# EAGLE design MEGAMOTHERBOARD (EAGLE 7.6.0)
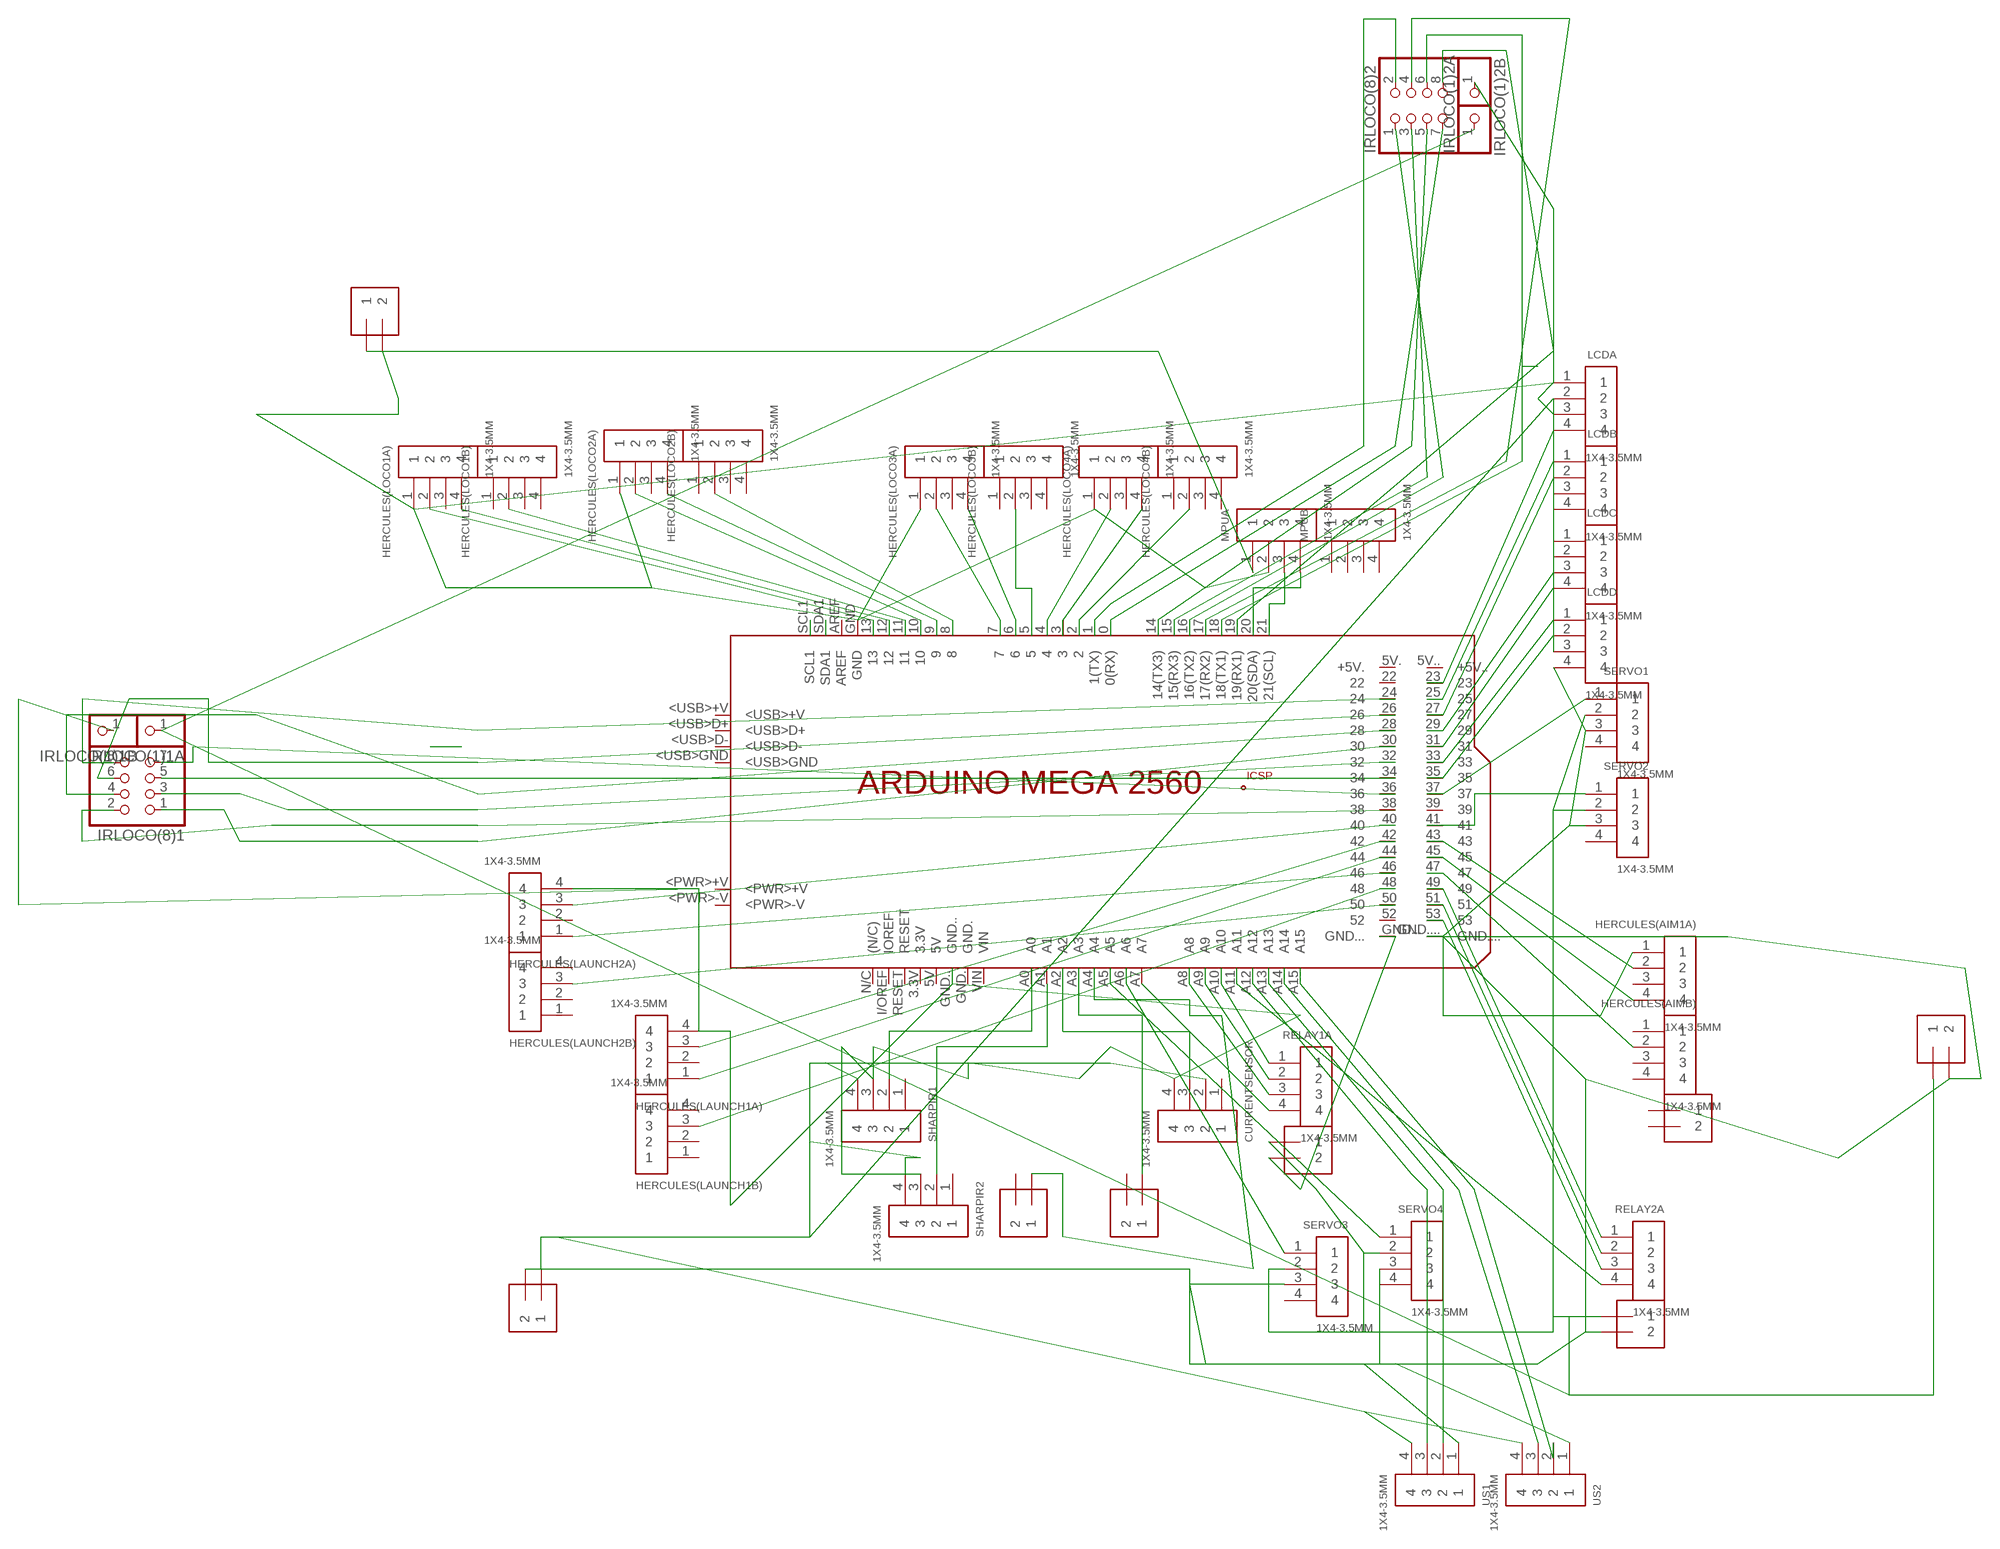
[diagram p0: schematic, sheet 1]

## Parts
3.3V  1X2-3.5MM  [1X2-3.5MM]
5V  1X2-3.5MM  [1X2-3.5MM]
12V  1X2-3.5MM  [1X2-3.5MM]
CURRENTSENSOR  1X4-3.5MM  [1X04-3.5MM]
HERCULES(AIM1A)  1X4-3.5MM  [1X04-3.5MM]
HERCULES(AIM1C)  1X2-3.5MM  [1X2-3.5MM]
HERCULES(AIMB)  1X4-3.5MM  [1X04-3.5MM]
HERCULES(LAUNCH1A)  1X4-3.5MM  [1X04-3.5MM]
HERCULES(LAUNCH1B)  1X4-3.5MM  [1X04-3.5MM]
HERCULES(LAUNCH2A)  1X4-3.5MM  [1X04-3.5MM]
HERCULES(LAUNCH2B)  1X4-3.5MM  [1X04-3.5MM]
HERCULES(LOCO1A)  1X4-3.5MM  [1X04-3.5MM]
HERCULES(LOCO1B)  1X4-3.5MM  [1X04-3.5MM]
HERCULES(LOCO2A)  1X4-3.5MM  [1X04-3.5MM]
HERCULES(LOCO2B)  1X4-3.5MM  [1X04-3.5MM]
HERCULES(LOCO3A)  1X4-3.5MM  [1X04-3.5MM]
HERCULES(LOCO3B)  1X4-3.5MM  [1X04-3.5MM]
HERCULES(LOCO4A)  1X4-3.5MM  [1X04-3.5MM]
HERCULES(LOCO4B)  1X4-3.5MM  [1X04-3.5MM]
IRLOCO1ANALOG  1X2-3.5MM  [1X2-3.5MM]
IRLOCO2ANALOG  1X2-3.5MM  [1X2-3.5MM]
IRLOCO(1)1A  PINHD-1X1  [1X01]
IRLOCO(1)1B  PINHD-1X1  [1X01]
IRLOCO(1)2A  PINHD-1X1  [1X01]
IRLOCO(1)2B  PINHD-1X1  [1X01]
IRLOCO(8)1  PINHD-2X4  [2X04]
IRLOCO(8)2  PINHD-2X4  [2X04]
LCDA  1X4-3.5MM  [1X04-3.5MM]
LCDB  1X4-3.5MM  [1X04-3.5MM]
LCDC  1X4-3.5MM  [1X04-3.5MM]
LCDD  1X4-3.5MM  [1X04-3.5MM]
MPUA  1X4-3.5MM  [1X04-3.5MM]
MPUB  1X4-3.5MM  [1X04-3.5MM]
PCB1  ARDUINO_MEGA2560  [ARDUINO_MEGA2560]
RELAY1A  1X4-3.5MM  [1X04-3.5MM]
RELAY1B  1X2-3.5MM  [1X2-3.5MM]
RELAY2A  1X4-3.5MM  [1X04-3.5MM]
RELAY2B  1X2-3.5MM  [1X2-3.5MM]
SERVO1  1X4-3.5MM  [1X04-3.5MM]
SERVO2  1X4-3.5MM  [1X04-3.5MM]
SERVO3  1X4-3.5MM  [1X04-3.5MM]
SERVO4  1X4-3.5MM  [1X04-3.5MM]
SHARPIR1  1X4-3.5MM  [1X04-3.5MM]
SHARPIR2  1X4-3.5MM  [1X04-3.5MM]
US1  1X4-3.5MM  [1X04-3.5MM]
US2  1X4-3.5MM  [1X04-3.5MM]

## Nets
3.3V: 3.3V.1 MPUA.1
5V: 5V.1 CURRENTSENSOR.2 LCDA.2 LCDD.3 SHARPIR1.4 SHARPIR2.4 US1.4 US2.4
12V: 12V.1 IRLOCO(1)1A.1 IRLOCO(1)2A.1 RELAY1B.1 RELAY2B.1 SERVO1.2 SERVO2.2 SERVO3.2 SERVO4.2
CURRRENTSENSOR(ANALOG): CURRENTSENSOR.3 PCB1.A2
D0: LCDD.2 PCB1.35
D1: LCDD.1 PCB1.33
D2: LCDC.4 PCB1.31
D3: LCDC.3 PCB1.29
DIR1(HERCULESLAUNCH1): HERCULES(LAUNCH1A).3 PCB1.42
DIR1(HERCULESLAUNCH2): HERCULES(LAUNCH2A).3 PCB1.40
DIR1(HERCULESLOCO1): HERCULES(LOCO1A).2 PCB1.13
DIR1(HERCULESLOCO2): HERCULES(LOCO2A).2 PCB1.10
DIR1(HERCULESLOCO3): HERCULES(LOCO3A).2 PCB1.7
DIR1(HERCULESLOCO4): HERCULES(LOCO4A).2 PCB1.4
DIR2(HERCULESLAUNCH2): HERCULES(LAUNCH2B).3 PCB1.50
DIR2(HERCULESLAUNCH): HERCULES(LAUNCH1B).3 PCB1.48
DIR2(HERCULESLOCO1): HERCULES(LOCO1B).2 PCB1.11
DIR2(HERCULESLOCO2): HERCULES(LOCO2B).2 PCB1.8
DIR2(HERCULESLOCO3): HERCULES(LOCO3B).2 PCB1.5
DIR2HERCULESLOCO4): HERCULES(LOCO4B).2 PCB1.2
ECHO(US1): PCB1.A13 US1.2
ECHO(US2): PCB1.A15 US2.2
ENABLE: LCDB.1 PCB1.25
GND1: CURRENTSENSOR.4 HERCULES(LAUNCH1A).4 HERCULES(LAUNCH2A).4 IRLOCO(1)1B.1 PCB1.GND.. SHARPIR1.3 SHARPIR2.3
GND3: 5V.2 12V.2 HERCULES(AIM1A).1 LCDD.4 PCB1.GND.... RELAY2B.2 SERVO1.3 SERVO2.3 SERVO3.3 SERVO4.3 US1.1 US2.1
GND4: 3.3V.2 HERCULES(LOCO1A).1 HERCULES(LOCO2A).1 HERCULES(LOCO3A).1 HERCULES(LOCO4A).1 IRLOCO(1)2B.1 LCDA.1 LCDA.3 MPUA.2 PCB1.GND
HERCULES(AIM)DIR1: HERCULES(AIM1A).2 PCB1.43
HERCULES(AIM)DIR2: HERCULES(AIMB).2 PCB1.47
HERCULES(AIM)PWM: HERCULES(AIM1A).4 PCB1.45
IR1(D1): IRLOCO(8)2.1 PCB1.16(16(TX2))
IR1(D2): IRLOCO(8)2.2 PCB1.1(1(TX))
IR1(D3): IRLOCO(8)2.3 PCB1.15(15(RX3))
IR1(D4): IRLOCO(8)2.4 PCB1.17(17(RX2))
IR1(D5): IRLOCO(8)2.5 PCB1.14(14(TX3))
IR1(D6): IRLOCO(8)2.6 PCB1.18(18(TX1))
IR1(D8): IRLOCO(8)2.8 PCB1.19(19(RX1))
IR(D7): IRLOCO(8)2.7 PCB1.0(0(RX))
IRLOCO1: IRLOCO(8)1.1 PCB1.30
IRLOCO1(2): IRLOCO(8)1.2 PCB1.38
IRLOCO1(3): IRLOCO(8)1.3 PCB1.32
IRLOCO1(4): IRLOCO(8)1.4 PCB1.28
IRLOCO1(5): IRLOCO(8)1.5 PCB1.34
IRLOCO1(6): IRLOCO(8)1.6 PCB1.26
IRLOCO1(7): IRLOCO(8)1.7 PCB1.36
IRLOCO1(8): IRLOCO(8)1.8 PCB1.24
IRSENSORANALOG1(LOCO): IRLOCO2ANALOG.1 PCB1.A3
IRSENSORANALOG2(LOCO): IRLOCO1ANALOG.1 PCB1.A4
N$1: PCB1.41 SERVO2.1
N$2: PCB1.GND... RELAY1B.2
N$14: PCB1.SCL1
N$19: PCB1.SDA1
PWM1(HERCULESLOCO1): HERCULES(LOCO1A).4 PCB1.12
PWM(HERCULESLAUNCH2): HERCULES(LAUNCH2A).1 PCB1.46
PWM(HERCULESLAUNCH): HERCULES(LAUNCH1A).1 PCB1.44
PWM(HERCULESLOCO2): HERCULES(LOCO2A).4 PCB1.9
PWM(HERCULESLOCO3): HERCULES(LOCO3A).4 PCB1.6
PWM(HERCULESLOCO4): HERCULES(LOCO4A).4 PCB1.3
R/W: LCDB.2 PCB1.27
REGISTERSELECT: LCDA.4 PCB1.23
RELAY1(1): PCB1.A10 RELAY1A.1
RELAY1(2): PCB1.A9 RELAY1A.2
RELAY1(3): PCB1.A8 RELAY1A.3
RELAY1(4): PCB1.A7 RELAY1A.4
RELAY2(1): PCB1.49 RELAY2A.1
RELAY2(2): PCB1.51 RELAY2A.2
RELAY2(3): PCB1.53 RELAY2A.3
RELAY2(4): PCB1.A11 RELAY2A.4
SCL: MPUA.3 PCB1.21(21(SCL))
SDA: MPUA.4 PCB1.20(20(SDA))
SERVO1(I/P): PCB1.37 SERVO1.1
SERVO3(IPUT): PCB1.A6 SERVO3.1
SERVO4(I/P): PCB1.A5 SERVO4.1
SHARPIR2(ANALOG): PCB1.A1 SHARPIR2.2
SHARPIR(ANALOG1): PCB1.A0 SHARPIR1.2
TRIG(US1): PCB1.A12 US1.3
TRIG(US2): PCB1.A14 US2.3
Unconnected: CURRENTSENSOR.1 HERCULES(AIM1A).3 HERCULES(AIM1C).1 HERCULES(AIM1C).2 HERCULES(AIMB).1 HERCULES(AIMB).3 HERCULES(AIMB).4 HERCULES(LAUNCH1A).2 HERCULES(LAUNCH1B).1 HERCULES(LAUNCH1B).2 HERCULES(LAUNCH1B).4 HERCULES(LAUNCH2A).2 HERCULES(LAUNCH2B).1 HERCULES(LAUNCH2B).2 HERCULES(LAUNCH2B).4 HERCULES(LOCO1A).3 HERCULES(LOCO1B).1 HERCULES(LOCO1B).3 HERCULES(LOCO1B).4 HERCULES(LOCO2A).3 HERCULES(LOCO2B).1 HERCULES(LOCO2B).3 HERCULES(LOCO2B).4 HERCULES(LOCO3A).3 HERCULES(LOCO3B).1 HERCULES(LOCO3B).3 HERCULES(LOCO3B).4 HERCULES(LOCO4A).3 HERCULES(LOCO4B).1 HERCULES(LOCO4B).3 HERCULES(LOCO4B).4 IRLOCO1ANALOG.2 IRLOCO2ANALOG.2 LCDB.3 LCDB.4 LCDC.1 LCDC.2 MPUB.1 MPUB.2 MPUB.3 MPUB.4 PCB1.3.3V PCB1.5V PCB1.5V.(+5V.) PCB1.5V..(+5V..) PCB1.22 PCB1.39 PCB1.52 PCB1.+5V_ PCB1.<PWR>+V PCB1.<PWR>-V PCB1.<USB>+V PCB1.<USB>D+ PCB1.<USB>D- PCB1.<USB>GND PCB1.AREF PCB1.GND. PCB1.GND__ PCB1.I/OREF(IOREF) PCB1.MISO PCB1.MOSI PCB1.N/C((N/C)) PCB1.RESET PCB1.RESET. PCB1.SCK PCB1.VIN SERVO1.4 SERVO2.4 SERVO3.4 SERVO4.4 SHARPIR1.1 SHARPIR2.1

## Library data of the parts
3.3V 5V 12V HERCULES(AIM1C) IRLOCO1ANALOG IRLOCO2ANALOG RELAY1B RELAY2B = adafruit:1X2: 3.5mm Terminal block http://www.ladyada.net/library/pcb/eaglelibrary.html
CURRENTSENSOR HERCULES(AIM1A) HERCULES(AIMB) HERCULES(LAUNCH1A) HERCULES(LAUNCH1B) HERCULES(LAUNCH2A) HERCULES(LAUNCH2B) HERCULES(LOCO1A) HERCULES(LOCO1B) HERCULES(LOCO2A) HERCULES(LOCO2B) HERCULES(LOCO3A) HERCULES(LOCO3B) HERCULES(LOCO4A) HERCULES(LOCO4B) LCDA LCDB LCDC LCDD MPUA MPUB RELAY1A RELAY2A SERVO1-SERVO4 SHARPIR1 SHARPIR2 US1 US2 = adafruit:1X4: 4-pin connector
IRLOCO(1)1A IRLOCO(1)1B IRLOCO(1)2A IRLOCO(1)2B = adafruit:PINHD-1X1: Pin header 1x1 for 0.1" spacing With round pins
IRLOCO(8)1 IRLOCO(8)2 = adafruit:PINHD-2X4: PIN HEADER
PCB1 = E14_Arduino_revC:ARDUINO_MEGA2560: Device for representing an Arduino Mega 2560 board with a footprint in an EAGLE design. Created by Dave Young for Element14. More EAGLE documentation at: http://www.element14.com/community/community/knode/cadsoft_eagle

## Board
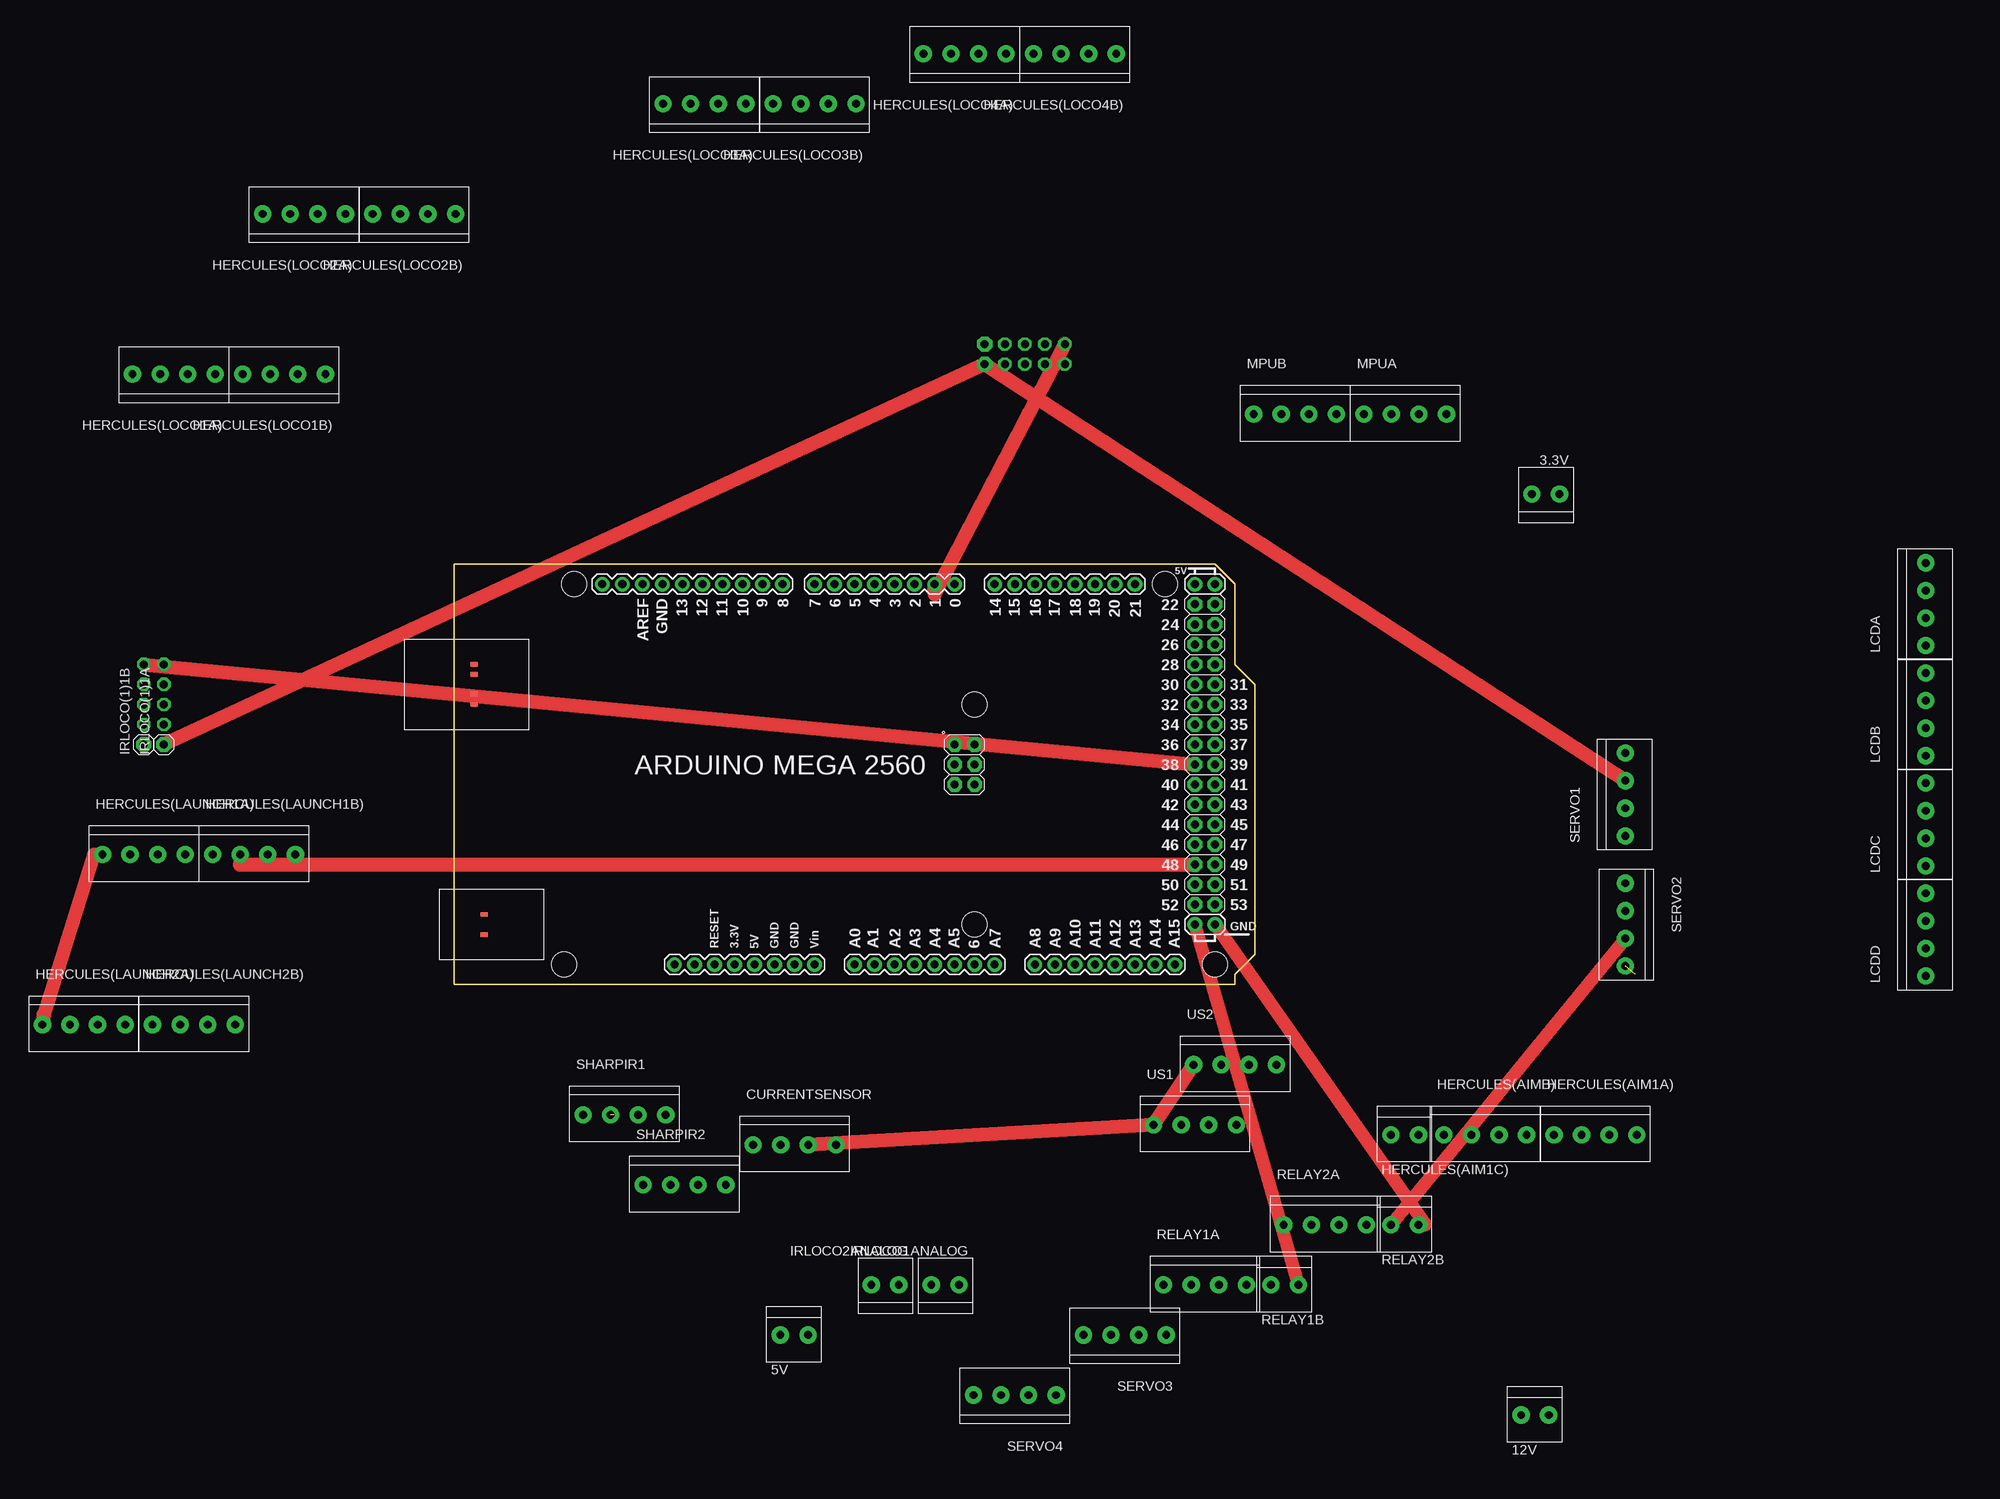
[diagram p1: board, top side]
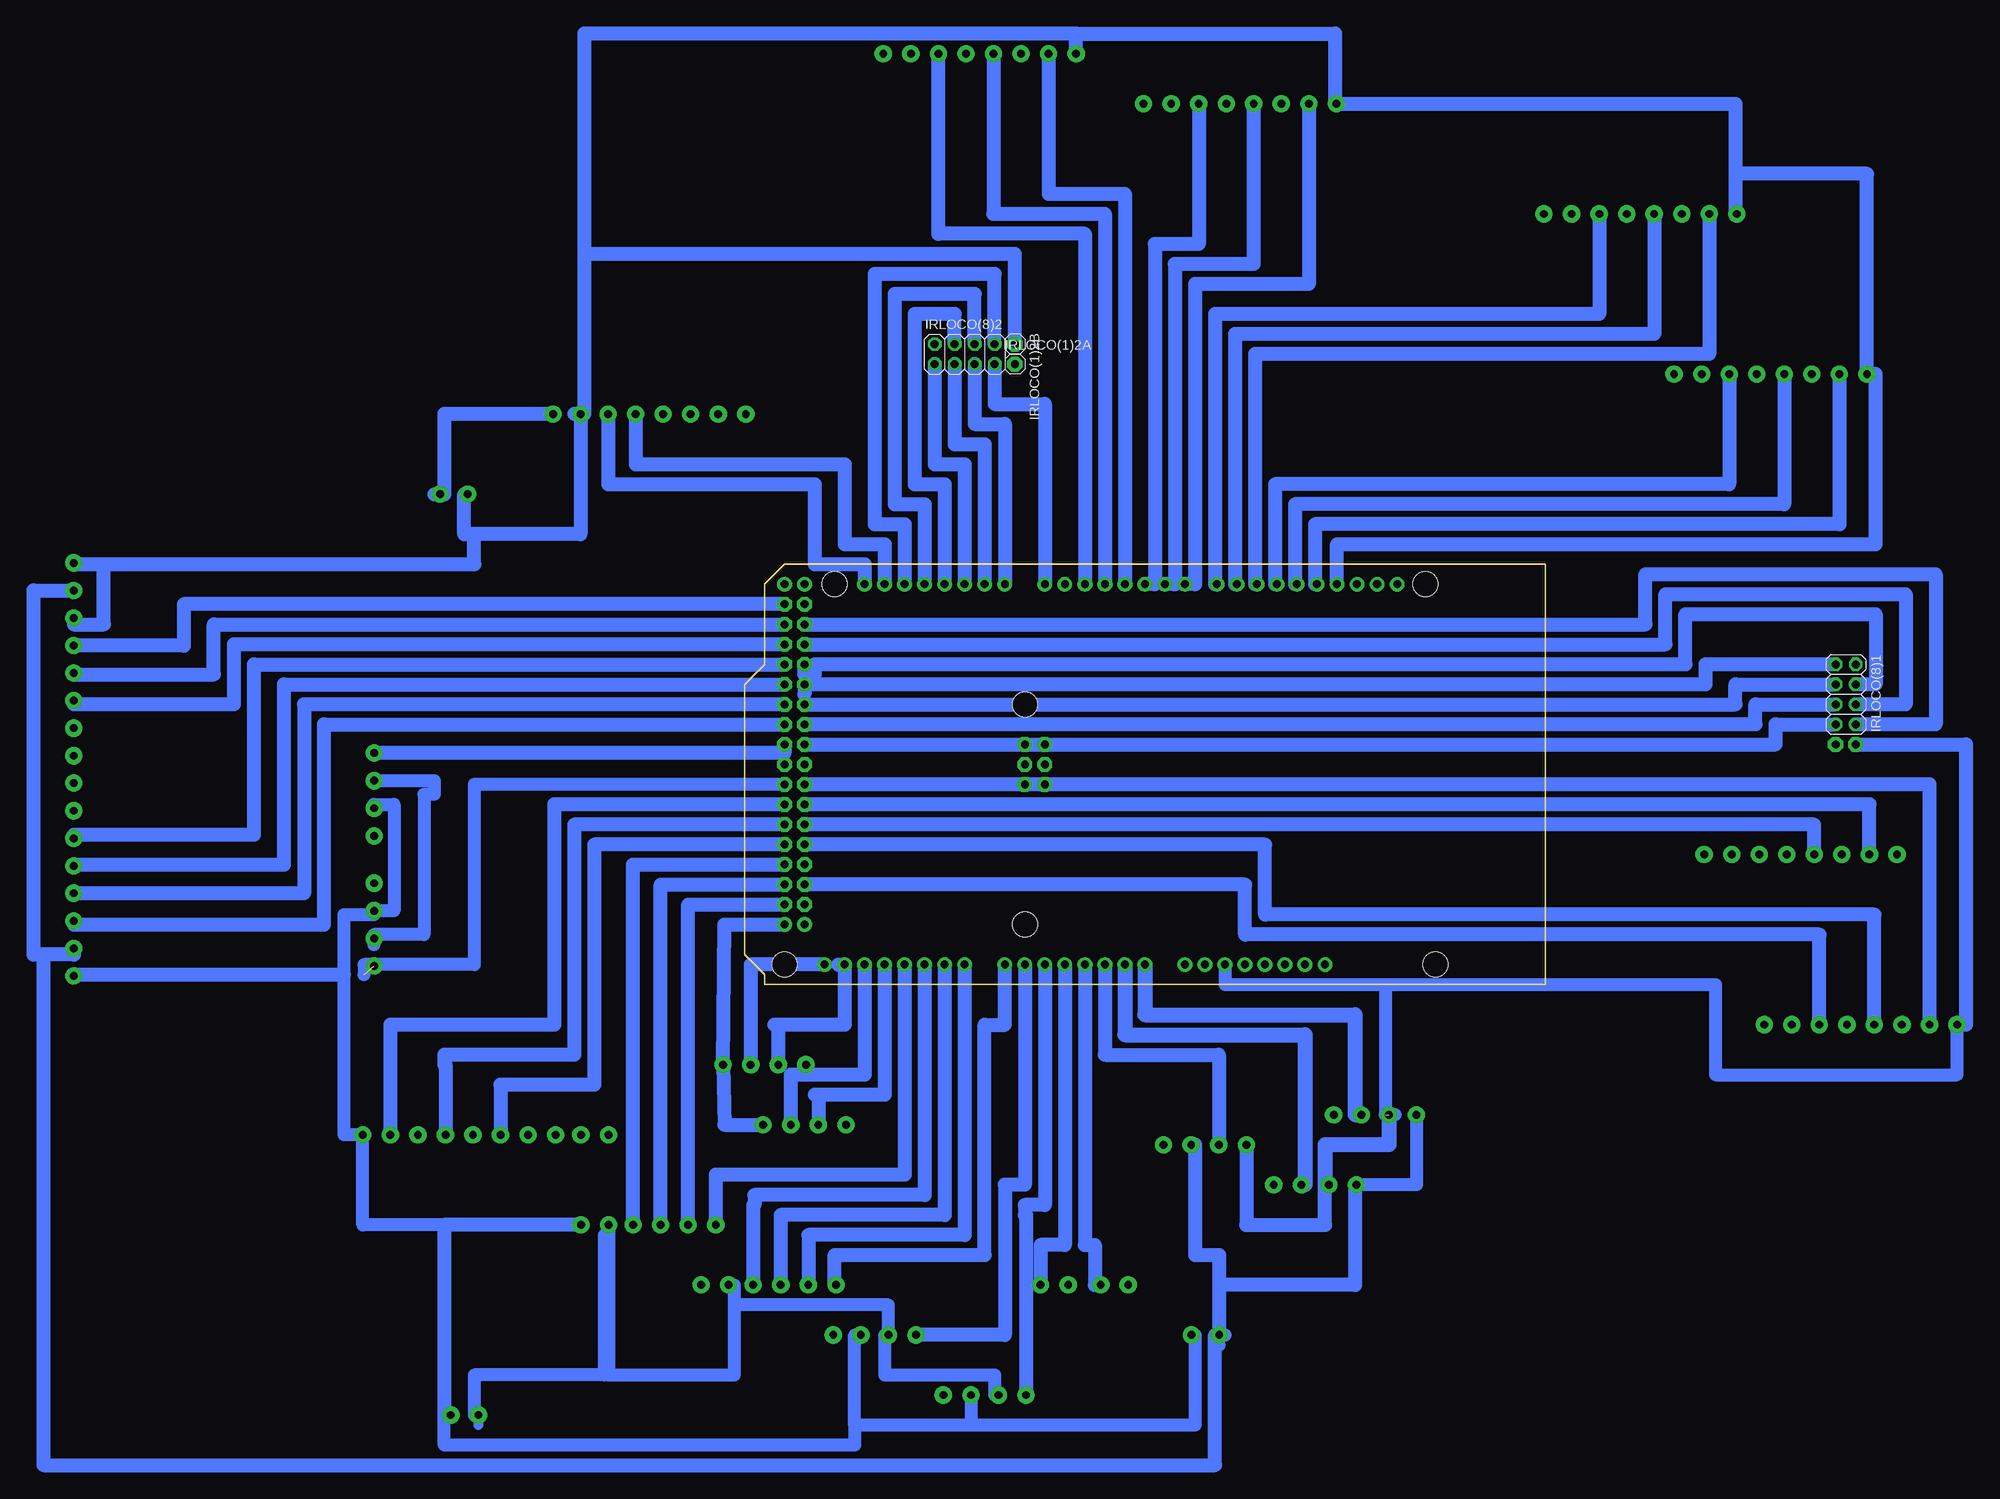
[diagram p2: board, bottom side, seen from below]

Size 101.6 x 53.34 mm. Coordinates in mm from the lower left corner, seen from the top.
Copper layers (1*16): Top 0.035mm / dielectric 1.5mm / Bottom 0.035mm
Design rules "default": minimum track width 10mil, minimum drill 24mil, track to track 8mil, track to pad 8mil, pad to pad 8mil, via to via 8mil, smd to smd 8mil, copper to edge 40mil, drill to drill 8mil, minimum pad ring 10mil, minimum via ring 8mil, stop-mask expansion 4mil, vias tented up to drill 0mil, thermal gap 10mil
Holes 0.6 mm at 349.25,13.97

### Footprints (pad centres in the part's own frame; a part is rotated, then mirrored left to right if it is on the bottom)
1X2-3.5MM = drill 1 pad 2.184: 1 1.8,0; 2 -1.7,0
1X04-3.5MM = drill 1 pad 2.184: 1 -5.25,0; 2 -1.75,0; 3 1.75,0; 4 5.25,0
1X01 = drill 1.016 pad 1.93 octagon: 1 0,0
2X04 = drill 1.016 pad 1.676 octagon: 1 -3.81,-1.27; 2 -3.81,1.27; 3 -1.27,-1.27; 4 -1.27,1.27; 5 1.27,-1.27; 6 1.27,1.27; 7 3.81,-1.27; 8 3.81,1.27
ARDUINO_MEGA2560 = drill 1.016 pad 1.88: 0 63.5,50.8; 1 60.96,50.8; 2 58.42,50.8; 3 55.88,50.8; 3.3V 35.56,2.54; 4 53.34,50.8; 5 50.8,50.8; 5V 38.1,2.54; 5V. 93.98,50.8; 5V.. 96.52,50.8; 6 48.26,50.8; 7 45.72,50.8; 8 41.656,50.8; 9 39.116,50.8; 10 36.576,50.8; 11 34.036,50.8; 12 31.496,50.8; 13 28.956,50.8; 14 68.58,50.8; 15 71.12,50.8; 16 73.66,50.8; 17 76.2,50.8; 18 78.74,50.8; 19 81.28,50.8; 20 83.82,50.8; 21 86.36,50.8; A0 50.8,2.54; A1 53.34,2.54; A2 55.88,2.54; A3 58.42,2.54; A4 60.96,2.54; A5 63.5,2.54; A6 66.04,2.54; A7 68.58,2.54; A8 73.66,2.54; A9 76.2,2.54; A10 78.74,2.54; A11 81.28,2.54; A12 83.82,2.54; A13 86.36,2.54; A14 88.9,2.54; A15 91.44,2.54; AREF 23.876,50.8; GND 26.416,50.8; GND. 43.18,2.54; GND.. 40.64,2.54; GND... 93.98,7.62; GND.... 96.52,7.62; I/OREF 30.48,2.54; N/C 27.94,2.54; RESET 33.02,2.54; SCL1 18.796,50.8; SDA1 21.336,50.8; VIN 45.72,2.54 | drill 1.016 pad 1.88 octagon: 22 93.98,48.26; 23 96.52,48.26; 24 93.98,45.72; 25 96.52,45.72; 26 93.98,43.18; 27 96.52,43.18; 28 93.98,40.64; 29 96.52,40.64; 30 93.98,38.1; 31 96.52,38.1; 32 93.98,35.56; 33 96.52,35.56; 34 93.98,33.02; 35 96.52,33.02; 36 93.98,30.48; 37 96.52,30.48; 38 93.98,27.94; 39 96.52,27.94; 40 93.98,25.4; 41 96.52,25.4; 42 93.98,22.86; 43 96.52,22.86; 44 93.98,20.32; 45 96.52,20.32; 46 93.98,17.78; 47 96.52,17.78; 48 93.98,15.24; 49 96.52,15.24; 50 93.98,12.7; 51 96.52,12.7; 52 93.98,10.16; 53 96.52,10.16; +5V_ 66.04,30.48; GND__ 66.04,25.4; MISO 63.5,30.48; MOSI 66.04,27.94; RESET. 63.5,25.4; SCK 63.5,27.94 | smd 1.016 x 0.508: <PWR>+V 3.81,8.89; <PWR>-V 3.81,6.35; <USB>+V 2.54,40.64; <USB>D+ 2.54,39.37; <USB>D- 2.54,36.83; <USB>GND 2.54,35.56 | hole 3.2: 15.24,50.8; 13.97,2.54; 66.04,35.56; 66.04,7.62; 90.17,50.8; 96.52,2.54

### Placement (x,y rotation side)
3.3V  138.43,62.23 0 top  (outside the outline)
5V  43.18,-44.45 180 top  (outside the outline)
12V  137.16,-54.61 180 top  (outside the outline)
CURRENTSENSOR  43.18,-20.32 180 top  (outside the outline)
HERCULES(AIM1A)  144.78,-19.05 180 top  (outside the outline)
HERCULES(AIM1C)  120.65,-19.05 180 top  (outside the outline)
HERCULES(AIMB)  130.81,-19.05 180 top  (outside the outline)
HERCULES(LAUNCH1A)  -39.37,16.51 180 top  (outside the outline)
HERCULES(LAUNCH1B)  -25.4,16.51 180 top  (outside the outline)
HERCULES(LAUNCH2A)  -46.99,-5.08 180 top  (outside the outline)
HERCULES(LAUNCH2B)  -33.02,-5.08 180 top  (outside the outline)
HERCULES(LOCO1A)  -35.56,77.47 0 top  (outside the outline)
HERCULES(LOCO1B)  -21.59,77.47 0 top  (outside the outline)
HERCULES(LOCO2A)  -19.05,97.79 0 top  (outside the outline)
HERCULES(LOCO2B)  -5.08,97.79 0 top  (outside the outline)
HERCULES(LOCO3A)  31.75,111.76 0 top  (outside the outline)
HERCULES(LOCO3B)  45.72,111.76 0 top  (outside the outline)
HERCULES(LOCO4A)  64.77,118.11 0 top  (outside the outline)
HERCULES(LOCO4B)  78.74,118.11 0 top  (outside the outline)
IRLOCO1ANALOG  62.23,-38.1 0 top  (outside the outline)
IRLOCO2ANALOG  54.61,-38.1 0 top  (outside the outline)
IRLOCO(1)1A  -36.83,30.48 90 top  (outside the outline)
IRLOCO(1)1B  -39.37,30.48 90 top  (outside the outline)
IRLOCO(1)2A  67.31,78.74 0 bottom  (outside the outline)
IRLOCO(1)2B  67.31,81.28 270 bottom  (outside the outline)
IRLOCO(8)1  -38.1,36.83 270 bottom  (outside the outline)
IRLOCO(8)2  73.66,80.01 0 bottom  (outside the outline)
LCDA  186.69,48.26 270 top  (outside the outline)
LCDB  186.69,34.29 270 top  (outside the outline)
LCDC  186.69,20.32 270 top  (outside the outline)
LCDD  186.69,6.35 270 top  (outside the outline)
MPUA  120.65,72.39 180 top  (outside the outline)
MPUB  106.68,72.39 180 top  (outside the outline)
PCB1  0,0 0 top
RELAY1A  95.25,-38.1 180 top  (outside the outline)
RELAY1B  105.41,-38.1 180 top  (outside the outline)
RELAY2A  110.49,-30.48 180 top  (outside the outline)
RELAY2B  120.65,-30.48 180 top  (outside the outline)
SERVO1  148.59,24.13 270 top  (outside the outline)
SERVO2  148.59,7.62 90 top  (outside the outline)
SERVO3  85.09,-44.45 0 top  (outside the outline)
SERVO4  71.12,-52.07 0 top  (outside the outline)
SHARPIR1  21.59,-16.51 180 top  (outside the outline)
SHARPIR2  29.21,-25.4 180 top  (outside the outline)
US1  93.98,-17.78 180 top  (outside the outline)
US2  99.06,-10.16 180 top  (outside the outline)

### Tracks (layer width: path | path; a pad name or v marks a point on that pad's centre or on a via)
3.3V
  Bottom 1.778: MPUA.1 139.7,72.39 139.7,62.23 3.3V.1 140.97,62.23
5V
  Top 1.778: US2.4 US1.4 CURRENTSENSOR.2
  Bottom 1.676: 41.38,-45.72 5V.1 40.64,-44.45 | SHARPIR1.4 16.34,-25.4 SHARPIR2.4
  Bottom 1.778: SHARPIR2.4 24.13,-25.4 24.13,-38.1 41.38,-38.1 | 41.38,-38.1 5V.1 41.91,-44.45 41.91,-60.96 190.5,-60.96 190.5,3.81 | CURRENTSENSOR.2 44.45,-20.32 44.45,-34.29 41.38,-34.29 41.38,-38.1 | LCDD.3 186.69,3.81 190.5,3.81 | LCDA.2 191.77,50.01 191.77,3.81 190.5,3.81
12V
  Top 1.676: SERVO2.2 RELAY2B.1
  Top 1.778: IRLOCO(1)1A.1 IRLOCO(1)2A.1 SERVO1.2
  Bottom 1.27: 12V.1 135.36,-55.88
  Bottom 1.676: SERVO1.2 140.97,25.88 140.97,24.13 142.24,24.13 142.24,6.35 148.59,6.35 SERVO2.2 148.59,5.08 | 12V.1 135.89,-54.61 135.89,-49.53 119.38,-49.53 119.38,-31.75 118.85,-31.75 RELAY2B.1 118.85,-49.53 102.87,-49.53 102.87,-40.64 | 102.87,-40.64 102.87,-38.1 RELAY1B.1 | 102.87,-40.64 83.34,-40.64 SERVO3.2 83.82,-44.45 83.82,-49.53 69.85,-49.53 69.85,-52.07 SERVO4.2
CURRRENTSENSOR(ANALOG)
  Bottom 1.778: PCB1.A2 55.88,-8.89 41.43,-8.89 CURRENTSENSOR.3
D0
  Bottom 1.778: LCDD.2 186.69,7.62 154.94,7.62 154.94,33.02 PCB1.35
D1
  Bottom 1.778: PCB1.33 157.48,35.56 157.48,11.6 LCDD.1
D2
  Bottom 1.778: LCDC.4 186.69,15.24 160.02,15.24 160.02,38.1 PCB1.31
D3
  Bottom 1.778: LCDC.3 186.69,19.05 163.83,19.05 163.83,40.64 PCB1.29
DIR1(HERCULESLAUNCH1)
  Bottom 1.778: HERCULES(LAUNCH1A).3 -41.12,22.86 PCB1.42
DIR1(HERCULESLAUNCH2)
  Bottom 1.778: HERCULES(LAUNCH2A).3 -48.74,25.4 PCB1.40
DIR1(HERCULESLOCO1)
  Bottom 1.778: HERCULES(LOCO1A).2 -37.31,58.42 29.21,58.42 29.21,50.8 PCB1.13
DIR1(HERCULESLOCO2)
  Bottom 1.778: HERCULES(LOCO2A).2 -20.8,80.01 36.83,80.01 36.83,50.8 PCB1.10
DIR1(HERCULESLOCO3)
  Bottom 1.778: HERCULES(LOCO3A).2 30,88.9 44.45,88.9 44.45,50.8 PCB1.7
DIR1(HERCULESLOCO4)
  Bottom 1.778: HERCULES(LOCO4A).2 63.02,100.33 53.34,100.33 PCB1.4
DIR2(HERCULESLAUNCH2)
  Bottom 1.778: HERCULES(LAUNCH2B).3 -34.77,6.35 38.1,6.35 38.1,12.7 PCB1.50
DIR2(HERCULESLAUNCH)
  Top 1.778: HERCULES(LAUNCH1B).3 -27.15,15.24 PCB1.48
DIR2(HERCULESLOCO1)
  Bottom 1.778: HERCULES(LOCO1B).2 -23.34,63.5 34.29,63.5 34.29,50.8 PCB1.11
DIR2(HERCULESLOCO2)
  Bottom 1.778: HERCULES(LOCO2B).2 -6.83,85.09 41.91,85.09 41.91,50.8 PCB1.8
DIR2(HERCULESLOCO3)
  Bottom 1.778: HERCULES(LOCO3B).2 43.97,93.98 49.53,93.98 49.53,50.8 PCB1.5
DIR2HERCULESLOCO4)
  Bottom 1.778: PCB1.2 58.42,95.25 76.99,95.25 HERCULES(LOCO4B).2
ECHO(US1)
  Bottom 1.778: PCB1.A13 86.36,-11.43 95.73,-11.43 US1.2
ECHO(US2)
  Bottom 1.778: PCB1.A15 100.81,2.54 US2.2
ENABLE
  Bottom 1.778: LCDB.1 186.69,39.37 168.91,39.37 168.91,45.72 PCB1.25
GND1  (1 unrouted)
  Top 1.676: -45.72,16.51 HERCULES(LAUNCH1A).4
  Top 1.778: -45.72,16.51 -52.07,-3.81 HERCULES(LAUNCH2A).4 | 38.1,-20.32 CURRENTSENSOR.4
  Bottom 1.676: PCB1.GND.. 40.64,0 20.32,0 | 20.32,0 20.32,-16.51 | 20.32,0 -21.59,0 -21.59,-11.43 -52.24,-11.43 HERCULES(LAUNCH2A).4 | 19.05,-16.51 SHARPIR1.3
  Bottom 1.778: IRLOCO(1)1B.1 -53.34,30.48 -53.34,-5.08 HERCULES(LAUNCH2A).4 | CURRENTSENSOR.4 37.93,-30.48 27.94,-30.48 27.94,-25.4
  Bottom 1.93: SHARPIR1.3 19.84,-20.32 27.94,-20.32 27.94,-25.4 SHARPIR2.3
GND3
  Top 1.676: PCB1.GND.... 123.19,-30.48 RELAY2B.2
  Bottom 1.676: SERVO1.3 148.59,22.86 146.05,22.86 146.05,9.37 SERVO2.3 148.59,8.89 152.4,8.89 152.4,1.27 152.4,-19.05 HERCULES(AIM1A).1 150.03,-30.48 139.7,-30.48 | SERVO4.3 72.87,-55.88 | 72.87,-55.88 87.63,-55.88 | 87.63,-55.88 87.63,-44.45 SERVO3.3 | 87.63,-55.88 87.63,-58.42 139.7,-58.42 139.7,-54.61 | 5V.2 44.45,-44.45 44.45,-55.88 72.87,-55.88
  Bottom 1.778: RELAY2B.2 139.7,-30.48 139.7,-54.61 12V.2 | LCDD.4 186.69,1.27 152.4,1.27 | 99.06,-17.78 US1.1 104.14,-17.78 US2.1 104.14,7.62 PCB1.GND....
GND4
  Bottom 1.676: -41.91,55.88 -41.91,66.04
  Bottom 1.778: -24.13,102.87 -40.81,102.87 HERCULES(LOCO1A).1 -41.91,77.47 -41.91,55.88 26.42,55.88 PCB1.GND | -24.13,102.87 -24.13,97.79 HERCULES(LOCO2A).1 | 59.52,120.65 26.67,120.65 26.67,111.76 HERCULES(LOCO3A).1 -24.13,111.76 -24.13,102.87 | HERCULES(LOCO4A).1 59.52,120.65 | 59.52,120.65 121.92,120.65 121.92,92.71 | 121.92,92.71 121.92,72.39 MPUA.2 | MPUA.2 123.19,72.39 | MPUA.2 122.4,57.15 135.89,57.15 | 3.3V.2 137.16,62.23 137.16,57.15 135.89,57.15 | LCDA.1 186.69,53.34 182.88,53.34 | 182.88,53.34 135.89,53.34 135.89,57.15 | LCDA.3 186.69,45.72 182.88,45.72 182.88,53.34 | IRLOCO(1)2B.1 67.31,92.71 121.92,92.71
HERCULES(AIM)DIR1
  Bottom 1.778: PCB1.43 125.73,22.86 125.73,-5.08 146.53,-5.08 HERCULES(AIM1A).2
HERCULES(AIM)DIR2
  Bottom 1.778: PCB1.47 120.65,17.78 120.65,-12.7 132.56,-12.7 HERCULES(AIMB).2
HERCULES(AIM)PWM
  Bottom 1.778: PCB1.45 123.19,20.32 123.19,-8.89 139.7,-8.89 139.7,-10.16 139.53,-10.16 HERCULES(AIM1A).4
IR1(D1)
  Bottom 1.778: IRLOCO(8)2.1 77.47,66.04 73.66,66.04 PCB1.16
IR1(D2)
  Top 1.778: IRLOCO(8)2.2 60.96,49.53 PCB1.1
IR1(D3)
  Bottom 1.778: IRLOCO(8)2.3 74.93,68.58 71.12,68.58 PCB1.15
IR1(D4)
  Bottom 1.778: IRLOCO(8)2.4 74.93,85.09 80.01,85.09 80.01,63.5 76.2,63.5 PCB1.17
IR1(D5)
  Bottom 1.778: IRLOCO(8)2.5 72.39,71.12 68.58,71.12 PCB1.14
IR1(D6)
  Bottom 1.778: IRLOCO(8)2.6 72.39,87.63 82.55,87.63 82.55,60.96 78.74,60.96 PCB1.18
IR1(D8)
  Bottom 1.778: IRLOCO(8)2.8 69.85,90.17 85.09,90.17 85.09,58.42 81.28,58.42 PCB1.19
IR(D7)
  Bottom 1.778: IRLOCO(8)2.7 69.85,73.66 63.5,73.66 PCB1.0
IRLOCO1
  Bottom 1.778: 93.98,36.83 PCB1.30 -20.32,38.1 -20.32,40.64 IRLOCO(8)1.1
IRLOCO1(2)
  Top 1.778: IRLOCO(8)1.2 PCB1.38
IRLOCO1(3)
  Bottom 1.778: PCB1.32 -24.13,35.56 -24.13,38.1 IRLOCO(8)1.3
IRLOCO1(4)
  Bottom 1.778: PCB1.28 93.98,39.37 92.71,39.37 92.71,40.64 -17.78,40.64 -17.78,46.99 -41.91,46.99 -41.91,38.1 IRLOCO(8)1.4
IRLOCO1(5)
  Bottom 1.778: PCB1.34 -26.67,33.02 -26.67,35.56 IRLOCO(8)1.5
IRLOCO1(6)
  Bottom 1.778: PCB1.26 -15.24,43.18 -15.24,49.53 -45.72,49.53 -45.72,35.56 IRLOCO(8)1.6
IRLOCO1(7)
  Bottom 1.778: PCB1.36 -29.21,30.48 -29.21,33.02 IRLOCO(8)1.7
IRLOCO1(8)
  Bottom 1.778: PCB1.24 -12.7,45.72 -12.7,52.07 -49.53,52.07 -49.53,33.02 IRLOCO(8)1.8
IRSENSORANALOG1(LOCO)
  Bottom 1.778: PCB1.A3 58.42,-33.02 57.15,-33.02 57.15,-38.1 IRLOCO2ANALOG.1
IRSENSORANALOG2(LOCO)
  Bottom 1.778: PCB1.A4 60.96,-33.02 64.03,-33.02 IRLOCO1ANALOG.1
N$1  (1 unrouted)
  Bottom 1.676: PCB1.41 135.89,25.4 135.89,2.54 149.86,2.54 149.86,1.27
N$2
  Top 1.676: PCB1.GND... RELAY1B.2
PWM1(HERCULESLOCO1)
  Bottom 1.778: HERCULES(LOCO1A).4 -30.31,60.96 31.75,60.96 31.75,50.8 PCB1.12
PWM(HERCULESLAUNCH2)
  Bottom 1.778: HERCULES(LAUNCH2A).1 -41.74,8.89 35.56,8.89 35.56,17.78 PCB1.46
PWM(HERCULESLAUNCH)
  Bottom 1.778: HERCULES(LAUNCH1A).1 -34.12,20.32 PCB1.44
PWM(HERCULESLOCO2)
  Bottom 1.778: HERCULES(LOCO2A).4 -13.8,82.55 39.37,82.55 39.37,50.8 PCB1.9
PWM(HERCULESLOCO3)
  Bottom 1.778: HERCULES(LOCO3A).4 37,91.44 46.99,91.44 46.99,50.8 PCB1.6
PWM(HERCULESLOCO4)
  Bottom 1.778: HERCULES(LOCO4A).4 70.02,97.79 55.88,97.79 PCB1.3
R/W
  Bottom 1.676: LCDB.2 186.69,35.56
  Bottom 1.778: PCB1.27 166.37,43.18 166.37,35.56 186.69,35.56
REGISTERSELECT
  Bottom 1.778: PCB1.23 172.72,48.26 172.72,43.01 LCDA.4
RELAY1(1)
  Bottom 1.778: PCB1.A10 78.74,-26.67 100.33,-26.67 100.33,-27.94 100.5,-27.94 RELAY1A.1
RELAY1(2)
  Bottom 1.778: PCB1.A9 76.2,-29.21 97,-29.21 RELAY1A.2
RELAY1(3)
  Bottom 1.778: PCB1.A8 73.66,-31.75 93.5,-31.75 RELAY1A.3
RELAY1(4)
  Bottom 1.778: RELAY1A.4 90.17,-38.1 90.17,-34.29 71.12,-34.29 71.12,-5.08 68.58,-5.08 PCB1.A7
RELAY2(1)
  Bottom 1.778: RELAY2A.1 115.74,15.24 PCB1.49
RELAY2(2)
  Bottom 1.778: RELAY2A.2 112.24,12.7 PCB1.51
RELAY2(3)
  Bottom 1.778: RELAY2A.3 108.74,10.16 PCB1.53
RELAY2(4)
  Bottom 1.778: PCB1.A11 81.28,-24.13 105.24,-24.13 RELAY2A.4
SCL
  Bottom 1.778: MPUA.3 118.9,63.5 92.71,63.5 92.71,53.34 86.36,53.34 PCB1.21
SDA
  Bottom 1.778: MPUA.4 115.4,66.04 88.9,66.04 88.9,55.88 83.82,55.88 PCB1.20
SERVO1(I/P)
  Bottom 1.778: PCB1.37 96.52,29.38 SERVO1.1
SERVO3(IPUT)
  Bottom 1.778: PCB1.A6 66.04,-25.4 68.58,-25.4 68.58,-44.45 SERVO3.1
SERVO4(I/P)
  Bottom 1.778: PCB1.A5 63.5,-27.94 66.04,-27.94 66.04,-29.21 65.87,-29.21 SERVO4.1
SHARPIR2(ANALOG)
  Bottom 1.93: PCB1.A1 53.34,-6.35 30.48,-6.35 30.48,-25.4 SHARPIR2.2
SHARPIR(ANALOG1)
  Bottom 1.93: PCB1.A0 50.8,-3.81 24.13,-3.81 24.13,-16.51 SHARPIR1.2
TRIG(US1)
  Bottom 1.778: PCB1.A12 83.82,-13.97 92.23,-13.97 | 92.71,-13.97 92.23,-13.97 | 92.23,-13.97 US1.3
TRIG(US2)
  Bottom 1.778: 89.69,2.54 PCB1.A14 88.9,-5.08 97.31,-5.08 | 97.79,-5.08 97.31,-5.08 | 97.31,-5.08 US2.3